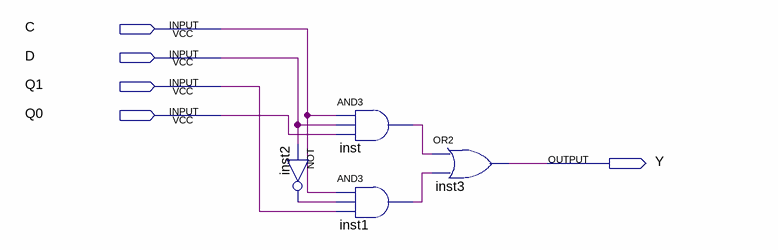
[diagram p0: schematic sheet]
// Quartus schematic MODULE_3.bdf as structural Verilog: 4 symbols, 5 pins
module MODULE_3 (
  input  C,
  input  D,
  input  Q1,
  input  Q0,
  output Y
);

  wire inst1_out, inst2_out, inst_out;

  not inst2 (inst2_out, D);
  and inst (inst_out, C, D, Q0);
  and inst1 (inst1_out, C, inst2_out, Q1);
  or inst3 (Y, inst_out, inst1_out);
endmodule
